# Altium schematic sheet IR80-250GF.SchDoc
size A4
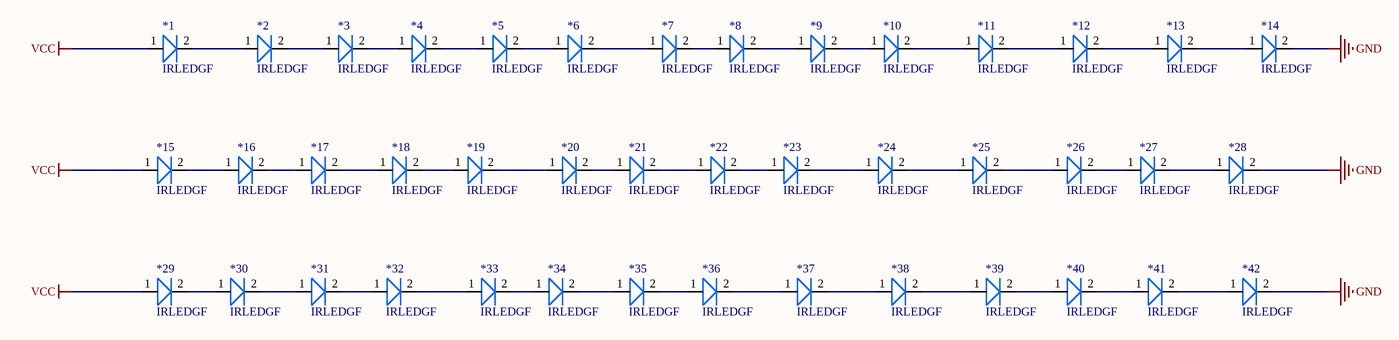
[diagram p0: IR80-250GF.SchDoc]

## Parts
*1  IRLEDGF  [LED 1W/3W]
*2  IRLEDGF  [LED 1W/3W]
*3  IRLEDGF  [LED 1W/3W]
*4  IRLEDGF  [LED 1W/3W]
*5  IRLEDGF  [LED 1W/3W]
*6  IRLEDGF  [LED 1W/3W]
*7  IRLEDGF  [LED 1W/3W]
*8  IRLEDGF  [LED 1W/3W]
*9  IRLEDGF  [LED 1W/3W]
*10  IRLEDGF  [LED 1W/3W]
*11  IRLEDGF  [LED 1W/3W]
*12  IRLEDGF  [LED 1W/3W]
*13  IRLEDGF  [LED 1W/3W]
*14  IRLEDGF  [LED 1W/3W]
*15  IRLEDGF  [LED 1W/3W]
*16  IRLEDGF  [LED 1W/3W]
*17  IRLEDGF  [LED 1W/3W]
*18  IRLEDGF  [LED 1W/3W]
*19  IRLEDGF  [LED 1W/3W]
*20  IRLEDGF  [LED 1W/3W]
*21  IRLEDGF  [LED 1W/3W]
*22  IRLEDGF  [LED 1W/3W]
*23  IRLEDGF  [LED 1W/3W]
*24  IRLEDGF  [LED 1W/3W]
*25  IRLEDGF  [LED 1W/3W]
*26  IRLEDGF  [LED 1W/3W]
*27  IRLEDGF  [LED 1W/3W]
*28  IRLEDGF  [LED 1W/3W]
*29  IRLEDGF  [LED 1W/3W]
*30  IRLEDGF  [LED 1W/3W]
*31  IRLEDGF  [LED 1W/3W]
*32  IRLEDGF  [LED 1W/3W]
*33  IRLEDGF  [LED 1W/3W]
*34  IRLEDGF  [LED 1W/3W]
*35  IRLEDGF  [LED 1W/3W]
*36  IRLEDGF  [LED 1W/3W]
*37  IRLEDGF  [LED 1W/3W]
*38  IRLEDGF  [LED 1W/3W]
*39  IRLEDGF  [LED 1W/3W]
*40  IRLEDGF  [LED 1W/3W]
*41  IRLEDGF  [LED 1W/3W]
*42  IRLEDGF  [LED 1W/3W]

## Nets
GND: *14.2(-) *28.2(-) *42.2(-)
VCC: *1.1(+) *15.1(+) *29.1(+)
Net*1_2: *1.2(-) *2.1(+)
Net*2_2: *2.2(-) *3.1(+)
Net*3_2: *3.2(-) *4.1(+)
Net*4_2: *4.2(-) *5.1(+)
Net*5_2: *5.2(-) *6.1(+)
Net*6_2: *6.2(-) *7.1(+)
Net*7_2: *7.2(-) *8.1(+)
Net*8_2: *8.2(-) *9.1(+)
Net*9_2: *9.2(-) *10.1(+)
Net*10_2: *10.2(-) *11.1(+)
Net*11_2: *11.2(-) *12.1(+)
Net*12_2: *12.2(-) *13.1(+)
Net*13_2: *13.2(-) *14.1(+)
Net*15_2: *15.2(-) *16.1(+)
Net*16_2: *16.2(-) *17.1(+)
Net*17_2: *17.2(-) *18.1(+)
Net*18_2: *18.2(-) *19.1(+)
Net*19_2: *19.2(-) *20.1(+)
Net*20_2: *20.2(-) *21.1(+)
Net*21_2: *21.2(-) *22.1(+)
Net*22_2: *22.2(-) *23.1(+)
Net*23_2: *23.2(-) *24.1(+)
Net*24_2: *24.2(-) *25.1(+)
Net*25_2: *25.2(-) *26.1(+)
Net*26_2: *26.2(-) *27.1(+)
Net*27_2: *27.2(-) *28.1(+)
Net*29_2: *29.2(-) *30.1(+)
Net*30_2: *30.2(-) *31.1(+)
Net*31_2: *31.2(-) *32.1(+)
Net*32_2: *32.2(-) *33.1(+)
Net*33_2: *33.2(-) *34.1(+)
Net*34_2: *34.2(-) *35.1(+)
Net*35_2: *35.2(-) *36.1(+)
Net*36_2: *36.2(-) *37.1(+)
Net*37_2: *37.2(-) *38.1(+)
Net*38_2: *38.2(-) *39.1(+)
Net*39_2: *39.2(-) *40.1(+)
Net*40_2: *40.2(-) *41.1(+)
Net*41_2: *41.2(-) *42.1(+)